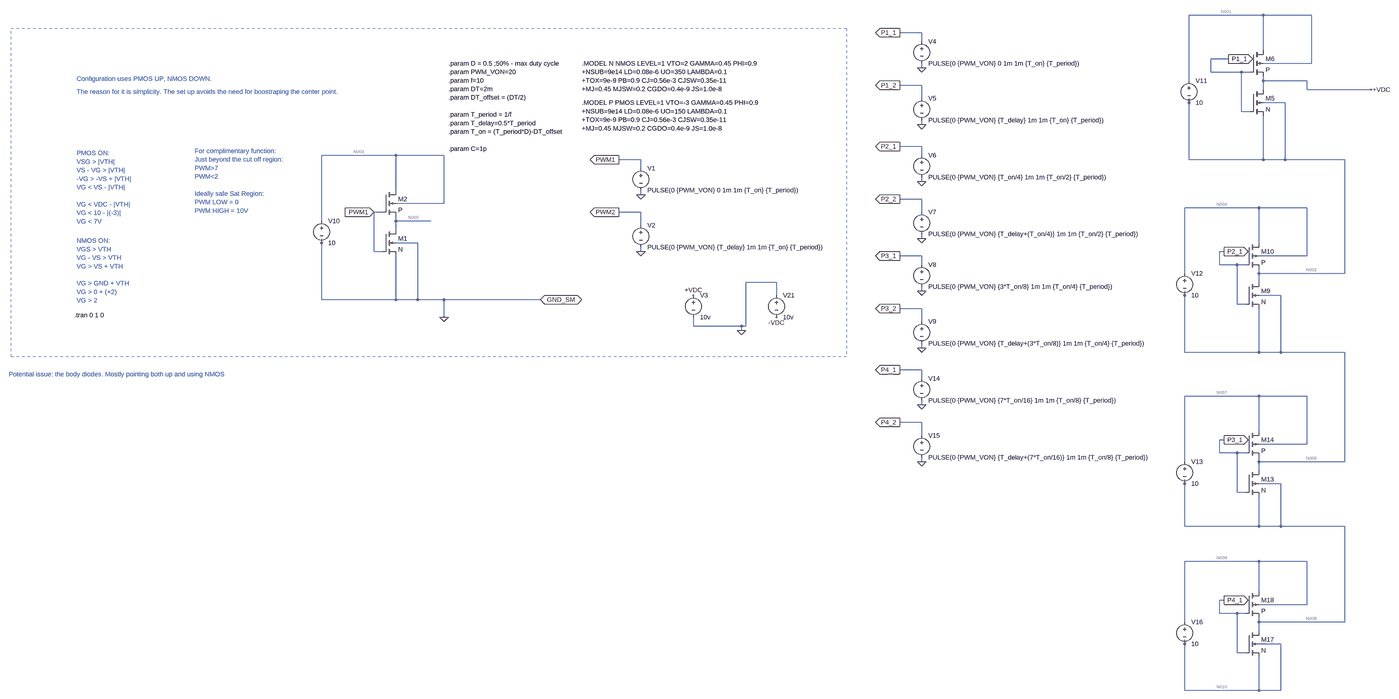
[diagram p0: schematic Half-Bridge.asc, whole sheet]
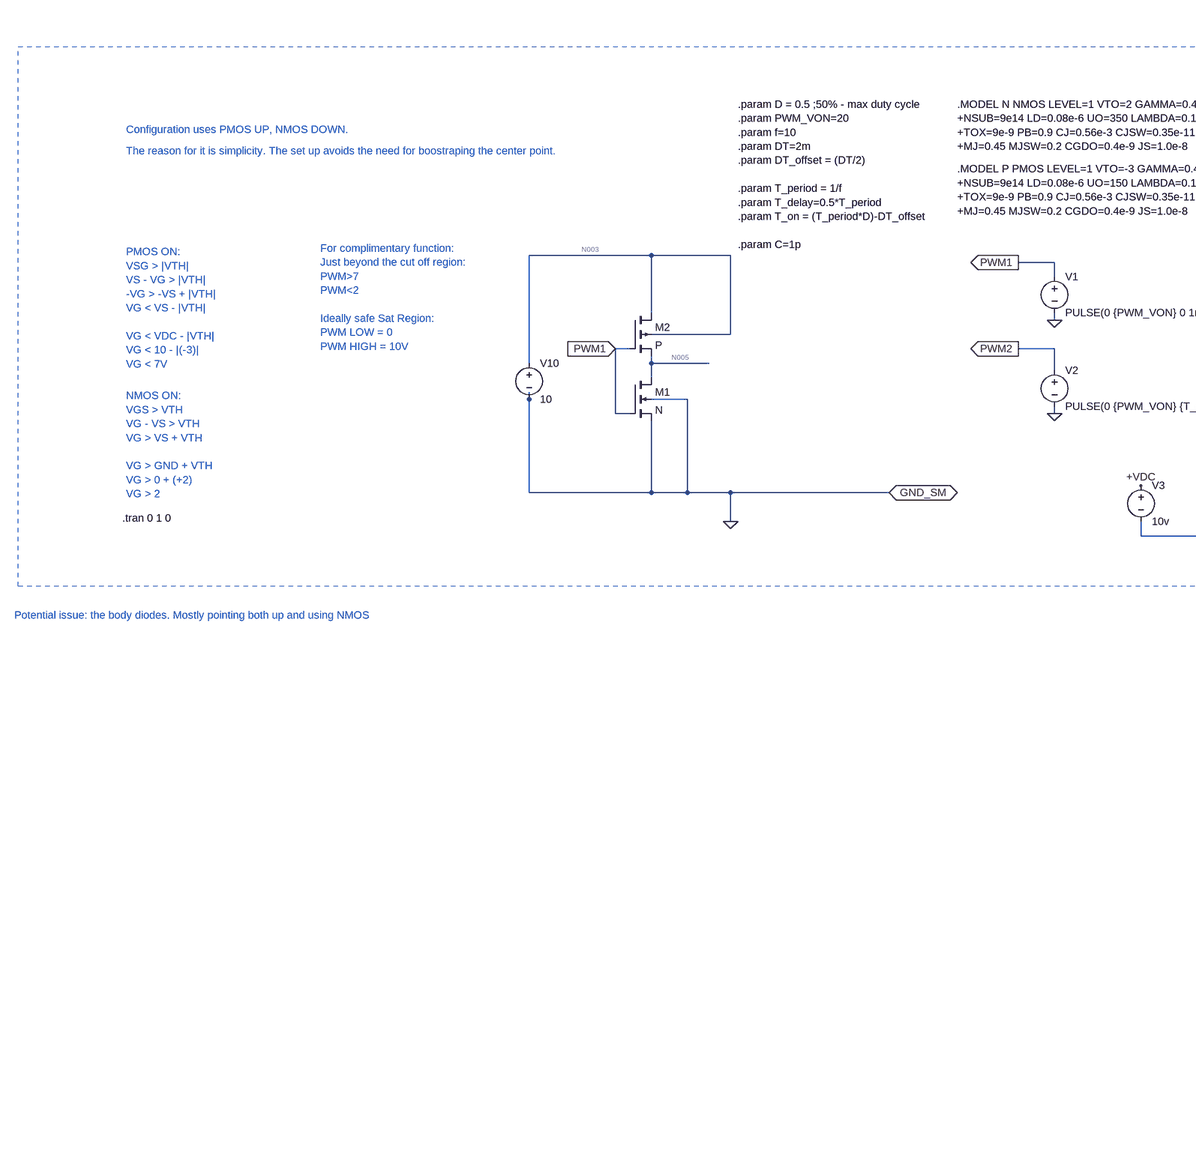
[diagram p1: schematic Half-Bridge.asc, part, row 1 of 1, column 1 of 2]
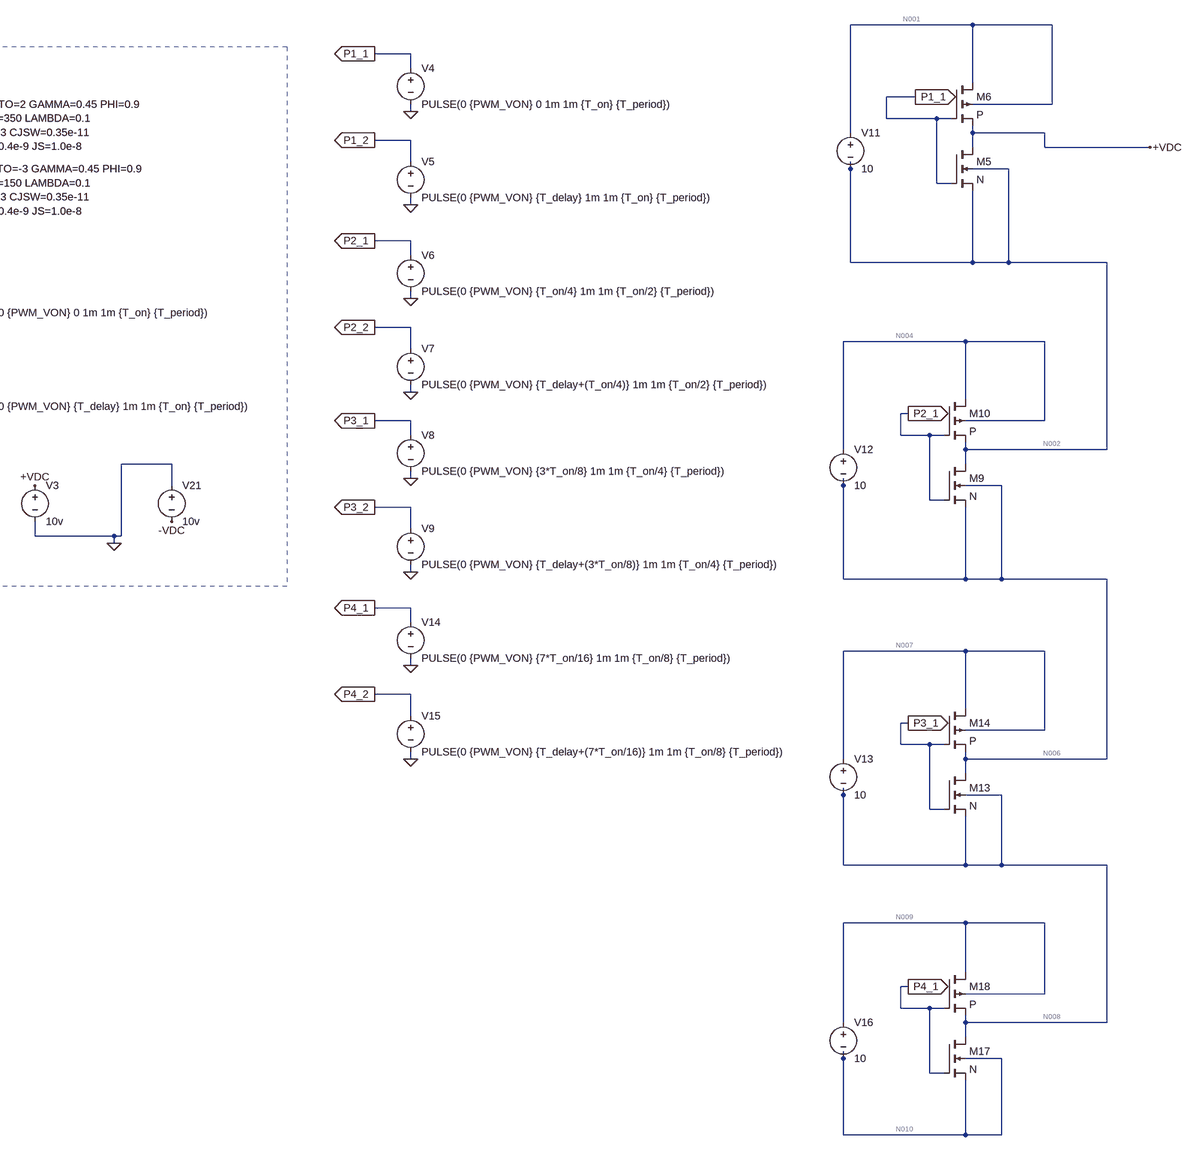
[diagram p2: schematic Half-Bridge.asc, part, row 1 of 1, column 2 of 2]
Half-Bridge.asc, the LTspice schematic file:
Version 4.1
SHEET 1 6916 5556
WIRE 5264 -480 4992 -480
WIRE 5440 -480 5264 -480
WIRE 3856 -416 3776 -416
WIRE 3856 -384 3856 -416
WIRE 5264 -352 5264 -480
WIRE 5136 -320 5072 -320
WIRE 5440 -304 5440 -480
WIRE 5440 -304 5264 -304
WIRE 3856 -288 3856 -304
WIRE 5072 -272 5072 -320
WIRE 5184 -272 5072 -272
WIRE 5216 -272 5184 -272
WIRE 4992 -240 4992 -480
WIRE 5264 -240 5264 -256
WIRE 5424 -240 5264 -240
WIRE 3856 -224 3776 -224
WIRE 5264 -208 5264 -240
WIRE 5424 -208 5424 -240
WIRE 5728 -208 5424 -208
WIRE 3856 -176 3856 -224
WIRE 4992 -160 4992 -176
WIRE 5344 -160 5264 -160
WIRE 5184 -128 5184 -272
WIRE 5216 -128 5184 -128
WIRE 3856 -80 3856 -96
WIRE 3856 0 3776 0
WIRE 1728 32 1456 32
WIRE 1904 32 1728 32
WIRE 3856 32 3856 0
WIRE 2624 48 2544 48
WIRE 4992 48 4992 -160
WIRE 5264 48 5264 -112
WIRE 5264 48 4992 48
WIRE 5344 48 5344 -160
WIRE 5344 48 5264 48
WIRE 5632 48 5344 48
WIRE 2624 80 2624 48
WIRE 3856 128 3856 112
WIRE 1728 160 1728 32
WIRE 2624 176 2624 160
WIRE 3856 192 3776 192
WIRE 1904 208 1904 32
WIRE 1904 208 1728 208
WIRE 5248 224 4976 224
WIRE 5424 224 5248 224
WIRE 1680 240 1648 240
WIRE 2624 240 2544 240
WIRE 3856 240 3856 192
WIRE 1456 272 1456 32
WIRE 1728 272 1728 256
WIRE 1856 272 1728 272
WIRE 2624 288 2624 240
WIRE 1728 304 1728 272
WIRE 3856 336 3856 320
WIRE 1456 352 1456 336
WIRE 1808 352 1728 352
WIRE 5248 352 5248 224
WIRE 1648 384 1648 240
WIRE 1680 384 1648 384
WIRE 2624 384 2624 368
WIRE 5120 384 5104 384
WIRE 3856 400 3776 400
WIRE 5424 400 5424 224
WIRE 5424 400 5248 400
WIRE 3856 432 3856 400
WIRE 5104 432 5104 384
WIRE 5168 432 5104 432
WIRE 5200 432 5168 432
WIRE 4976 464 4976 224
WIRE 5248 464 5248 448
WIRE 5632 464 5632 48
WIRE 5632 464 5248 464
WIRE 3120 496 3008 496
WIRE 5248 496 5248 464
WIRE 3856 528 3856 512
WIRE 3120 544 3120 496
WIRE 4976 544 4976 528
WIRE 5328 544 5248 544
WIRE 1456 560 1456 352
WIRE 1728 560 1728 400
WIRE 1728 560 1456 560
WIRE 1808 560 1808 352
WIRE 1808 560 1728 560
WIRE 1904 560 1808 560
WIRE 2256 560 1904 560
WIRE 5168 576 5168 432
WIRE 5200 576 5168 576
WIRE 3856 592 3776 592
WIRE 1904 624 1904 560
WIRE 3856 640 3856 592
WIRE 2816 656 2816 624
WIRE 2992 656 2816 656
WIRE 3008 656 3008 496
WIRE 3008 656 2992 656
WIRE 2992 672 2992 656
WIRE 3856 736 3856 720
WIRE 4976 752 4976 544
WIRE 5248 752 5248 592
WIRE 5248 752 4976 752
WIRE 5328 752 5328 544
WIRE 5328 752 5248 752
WIRE 5632 752 5328 752
WIRE 3856 816 3776 816
WIRE 3856 848 3856 816
WIRE 5248 912 4976 912
WIRE 5424 912 5248 912
WIRE 3856 944 3856 928
WIRE 3856 1008 3776 1008
WIRE 5248 1040 5248 912
WIRE 3856 1056 3856 1008
WIRE 5120 1072 5104 1072
WIRE 5424 1088 5424 912
WIRE 5424 1088 5248 1088
WIRE 5104 1120 5104 1072
WIRE 5168 1120 5104 1120
WIRE 5200 1120 5168 1120
WIRE 3856 1152 3856 1136
WIRE 4976 1152 4976 912
WIRE 5248 1152 5248 1136
WIRE 5632 1152 5632 752
WIRE 5632 1152 5248 1152
WIRE 5248 1184 5248 1152
WIRE 4976 1232 4976 1216
WIRE 5328 1232 5248 1232
WIRE 5168 1264 5168 1120
WIRE 5200 1264 5168 1264
WIRE 4976 1440 4976 1232
WIRE 5248 1440 5248 1280
WIRE 5248 1440 4976 1440
WIRE 5328 1440 5328 1232
WIRE 5328 1440 5248 1440
WIRE 5632 1440 5328 1440
WIRE 5248 1600 4976 1600
WIRE 5424 1600 5248 1600
WIRE 5248 1728 5248 1600
WIRE 5120 1760 5104 1760
WIRE 5424 1776 5424 1600
WIRE 5424 1776 5248 1776
WIRE 5104 1808 5104 1760
WIRE 5168 1808 5104 1808
WIRE 5200 1808 5168 1808
WIRE 4976 1840 4976 1600
WIRE 5248 1840 5248 1824
WIRE 5632 1840 5632 1440
WIRE 5632 1840 5248 1840
WIRE 5248 1872 5248 1840
WIRE 4976 1920 4976 1904
WIRE 5328 1920 5248 1920
WIRE 5168 1952 5168 1808
WIRE 5200 1952 5168 1952
WIRE 4976 2128 4976 1920
WIRE 5248 2128 5248 1968
WIRE 5248 2128 4976 2128
WIRE 5328 2128 5328 1920
WIRE 5328 2128 5248 2128
FLAG 1648 240 PWM1
IOPIN 1648 240 In
FLAG 2624 176 0
FLAG 2624 384 0
FLAG 2544 48 PWM1
IOPIN 2544 48 Out
FLAG 2544 240 PWM2
IOPIN 2544 240 Out
FLAG 2256 560 GND_SM
IOPIN 2256 560 BiDir
FLAG 1904 624 0
FLAG 3856 -288 0
FLAG 3856 -80 0
FLAG 3776 -416 P1_1
IOPIN 3776 -416 Out
FLAG 3776 -224 P1_2
IOPIN 3776 -224 Out
FLAG 3856 128 0
FLAG 3856 336 0
FLAG 3776 0 P2_1
IOPIN 3776 0 Out
FLAG 3776 192 P2_2
IOPIN 3776 192 Out
FLAG 3856 528 0
FLAG 3856 736 0
FLAG 3776 400 P3_1
IOPIN 3776 400 Out
FLAG 3776 592 P3_2
IOPIN 3776 592 Out
FLAG 5136 -320 P1_1
IOPIN 5136 -320 Out
FLAG 5120 384 P2_1
IOPIN 5120 384 Out
FLAG 5120 1072 P3_1
IOPIN 5120 1072 Out
FLAG 3856 944 0
FLAG 3856 1152 0
FLAG 3776 816 P4_1
IOPIN 3776 816 Out
FLAG 3776 1008 P4_2
IOPIN 3776 1008 Out
FLAG 5120 1760 P4_1
IOPIN 5120 1760 Out
FLAG 2992 672 0
FLAG 2816 544 +VDC
FLAG 3120 624 -VDC
FLAG 5728 -208 +VDC
SYMBOL nmos4 1680 304 R0
SYMATTR InstName M1
SYMATTR Value N
SYMBOL pmos4 1680 160 R0
SYMATTR InstName M2
SYMATTR Value P
SYMBOL voltage 2624 64 R0
WINDOW 123 0 0 Left 0
WINDOW 39 0 0 Left 0
SYMATTR InstName V1
SYMATTR Value PULSE(0 {PWM_VON} 0 1m 1m {T_on} {T_period})
SYMBOL voltage 2624 272 R0
WINDOW 123 0 0 Left 0
WINDOW 39 0 0 Left 0
SYMATTR InstName V2
SYMATTR Value PULSE(0 {PWM_VON} {T_delay} 1m 1m {T_on} {T_period})
SYMBOL voltage 2816 528 R0
WINDOW 123 0 0 Left 0
WINDOW 39 0 0 Left 0
SYMATTR InstName V3
SYMATTR Value 10v
SYMBOL voltage 3856 -400 R0
WINDOW 123 0 0 Left 0
WINDOW 39 0 0 Left 0
SYMATTR InstName V4
SYMATTR Value PULSE(0 {PWM_VON} 0 1m 1m {T_on} {T_period})
SYMBOL voltage 3856 -192 R0
WINDOW 123 0 0 Left 0
WINDOW 39 0 0 Left 0
SYMATTR InstName V5
SYMATTR Value PULSE(0 {PWM_VON} {T_delay} 1m 1m {T_on} {T_period})
SYMBOL voltage 3856 16 R0
WINDOW 123 0 0 Left 0
WINDOW 39 0 0 Left 0
SYMATTR InstName V6
SYMATTR Value PULSE(0 {PWM_VON} {T_on/4} 1m 1m {T_on/2} {T_period})
SYMBOL voltage 3856 224 R0
WINDOW 123 0 0 Left 0
WINDOW 39 0 0 Left 0
SYMATTR InstName V7
SYMATTR Value PULSE(0 {PWM_VON} {T_delay+(T_on/4)} 1m 1m {T_on/2} {T_period})
SYMBOL voltage 3856 416 R0
WINDOW 123 0 0 Left 0
WINDOW 39 0 0 Left 0
SYMATTR InstName V8
SYMATTR Value PULSE(0 {PWM_VON} {3*T_on/8} 1m 1m {T_on/4} {T_period})
SYMBOL voltage 3856 624 R0
WINDOW 123 0 0 Left 0
WINDOW 39 0 0 Left 0
SYMATTR InstName V9
SYMATTR Value PULSE(0 {PWM_VON} {T_delay+(3*T_on/8)} 1m 1m {T_on/4} {T_period})
SYMBOL voltage 1456 256 R0
WINDOW 123 0 0 Left 0
WINDOW 39 0 0 Left 0
SYMATTR InstName V10
SYMATTR Value 10
SYMBOL nmos4 5216 -208 R0
SYMATTR InstName M5
SYMATTR Value N
SYMBOL pmos4 5216 -352 R0
SYMATTR InstName M6
SYMATTR Value P
SYMBOL voltage 4992 -256 R0
WINDOW 123 0 0 Left 0
WINDOW 39 0 0 Left 0
SYMATTR InstName V11
SYMATTR Value 10
SYMBOL nmos4 5200 496 R0
SYMATTR InstName M9
SYMATTR Value N
SYMBOL pmos4 5200 352 R0
SYMATTR InstName M10
SYMATTR Value P
SYMBOL voltage 4976 448 R0
WINDOW 123 0 0 Left 0
WINDOW 39 0 0 Left 0
SYMATTR InstName V12
SYMATTR Value 10
SYMBOL nmos4 5200 1184 R0
SYMATTR InstName M13
SYMATTR Value N
SYMBOL pmos4 5200 1040 R0
SYMATTR InstName M14
SYMATTR Value P
SYMBOL voltage 4976 1136 R0
WINDOW 123 0 0 Left 0
WINDOW 39 0 0 Left 0
SYMATTR InstName V13
SYMATTR Value 10
SYMBOL voltage 3856 832 R0
WINDOW 123 0 0 Left 0
WINDOW 39 0 0 Left 0
SYMATTR InstName V14
SYMATTR Value PULSE(0 {PWM_VON} {7*T_on/16} 1m 1m {T_on/8} {T_period})
SYMBOL voltage 3856 1040 R0
WINDOW 123 0 0 Left 0
WINDOW 39 0 0 Left 0
SYMATTR InstName V15
SYMATTR Value PULSE(0 {PWM_VON} {T_delay+(7*T_on/16)} 1m 1m {T_on/8} {T_period})
SYMBOL nmos4 5200 1872 R0
SYMATTR InstName M17
SYMATTR Value N
SYMBOL pmos4 5200 1728 R0
SYMATTR InstName M18
SYMATTR Value P
SYMBOL voltage 4976 1824 R0
WINDOW 123 0 0 Left 0
WINDOW 39 0 0 Left 0
SYMATTR InstName V16
SYMATTR Value 10
SYMBOL voltage 3120 528 R0
WINDOW 123 0 0 Left 0
WINDOW 39 0 0 Left 0
SYMATTR InstName V21
SYMATTR Value 10v
TEXT 2408 -304 Left 2 !.MODEL N NMOS LEVEL=1 VTO=2 GAMMA=0.45 PHI=0.9\n+NSUB=9e14 LD=0.08e-6 UO=350 LAMBDA=0.1\n+TOX=9e-9 PB=0.9 CJ=0.56e-3 CJSW=0.35e-11\n+MJ=0.45 MJSW=0.2 CGDO=0.4e-9 JS=1.0e-8
TEXT 2408 -160 Left 2 !.MODEL P PMOS LEVEL=1 VTO=-3 GAMMA=0.45 PHI=0.9\n+NSUB=9e14 LD=0.08e-6 UO=150 LAMBDA=0.1\n+TOX=9e-9 PB=0.9 CJ=0.56e-3 CJSW=0.35e-11\n+MJ=0.45 MJSW=0.2 CGDO=0.4e-9 JS=1.0e-8
TEXT 560 -248 Left 2 ;Configuration uses PMOS UP, NMOS DOWN.
TEXT 560 -200 Left 2 ;The reason for it is simplicity. The set up avoids the need for boostraping the center point.
TEXT 560 24 Left 2 ;PMOS ON: \nVSG > |VTH| \nVS - VG > |VTH| \n-VG > -VS + |VTH| \nVG < VS - |VTH| \n \nVG < VDC - |VTH| \nVG < 10 - |(-3)|\nVG < 7V
TEXT 560 344 Left 2 ;NMOS ON:\nVGS > VTH\nVG - VS > VTH \nVG > VS + VTH\n \nVG > GND + VTH \nVG > 0 + (+2) \nVG > 2
TEXT 992 16 Left 2 ;For complimentary function: \nJust beyond the cut off region: \nPWM>7 \nPWM<2\n \nIdeally safe Sat Region: \nPWM LOW = 0\nPWM HIGH = 10V
TEXT 552 616 Left 2 !.tran 0 1 0
TEXT 1920 -304 Left 2 !.param D = 0.5 ;50% - max duty cycle\n.param PWM_VON=20\n.param f=10\n.param DT=2m\n.param DT_offset = (DT/2)\n \n.param T_period = 1/f\n.param T_delay=0.5*T_period\n.param T_on = (T_period*D)-DT_offset\n \n.param C=1p
TEXT 312 832 Left 2 ;Potential issue: the body diodes. Mostly pointing both up and using NMOS
RECTANGLE Normal 3376 768 320 -432 2

The netlist it stands for:
* Half-Bridge.asc
M1 N005 PWM1 0 0 N
M2 N003 PWM1 N005 N003 P
V1 PWM1 0 PULSE(0 {PWM_VON} 0 1m 1m {T_on} {T_period})
V2 PWM2 0 PULSE(0 {PWM_VON} {T_delay} 1m 1m {T_on} {T_period})
V3 +VDC 0 10v
V4 P1_1 0 PULSE(0 {PWM_VON} 0 1m 1m {T_on} {T_period})
V5 P1_2 0 PULSE(0 {PWM_VON} {T_delay} 1m 1m {T_on} {T_period})
V6 P2_1 0 PULSE(0 {PWM_VON} {T_on/4} 1m 1m {T_on/2} {T_period})
V7 P2_2 0 PULSE(0 {PWM_VON} {T_delay+(T_on/4)} 1m 1m {T_on/2} {T_period})
V8 P3_1 0 PULSE(0 {PWM_VON} {3*T_on/8} 1m 1m {T_on/4} {T_period})
V9 P3_2 0 PULSE(0 {PWM_VON} {T_delay+(3*T_on/8)} 1m 1m {T_on/4} {T_period})
V10 N003 0 10
M5 +VDC P1_1 N002 N002 N
M6 N001 P1_1 +VDC N001 P
V11 N001 N002 10
M9 N002 P2_1 N006 N006 N
M10 N004 P2_1 N002 N004 P
V12 N004 N006 10
M13 N006 P3_1 N008 N008 N
M14 N007 P3_1 N006 N007 P
V13 N007 N008 10
V14 P4_1 0 PULSE(0 {PWM_VON} {7*T_on/16} 1m 1m {T_on/8} {T_period})
V15 P4_2 0 PULSE(0 {PWM_VON} {T_delay+(7*T_on/16)} 1m 1m {T_on/8} {T_period})
M17 N008 P4_1 N010 N010 N
M18 N009 P4_1 N008 N009 P
V16 N009 N010 10
V21 0 -VDC 10v
.model NMOS NMOS
.model PMOS PMOS
.lib standard.mos
.MODEL N NMOS LEVEL=1 VTO=2 GAMMA=0.45 PHI=0.9
+NSUB=9e14 LD=0.08e-6 UO=350 LAMBDA=0.1
+TOX=9e-9 PB=0.9 CJ=0.56e-3 CJSW=0.35e-11
+MJ=0.45 MJSW=0.2 CGDO=0.4e-9 JS=1.0e-8
.MODEL P PMOS LEVEL=1 VTO=-3 GAMMA=0.45 PHI=0.9
+NSUB=9e14 LD=0.08e-6 UO=150 LAMBDA=0.1
+TOX=9e-9 PB=0.9 CJ=0.56e-3 CJSW=0.35e-11
+MJ=0.45 MJSW=0.2 CGDO=0.4e-9 JS=1.0e-8
* Configuration uses PMOS UP, NMOS DOWN.
* The reason for it is simplicity. The set up avoids the need for boostraping the center point.
* PMOS ON:
* VSG > |VTH|
* VS - VG > |VTH|
* -VG > -VS + |VTH|
* VG < VS - |VTH|
* VG < VDC - |VTH|
* VG < 10 - |(-3)|
* VG < 7V
* NMOS ON:
* VGS > VTH
* VG - VS > VTH
* VG > VS + VTH
* VG > GND + VTH
* VG > 0 + (+2)
* VG > 2
* For complimentary function:
* Just beyond the cut off region:
* PWM>7
* PWM<2
* Ideally safe Sat Region:
* PWM LOW = 0
* PWM HIGH = 10V
.tran 0 1 0
.param D = 0.5 ;50% - max duty cycle
.param PWM_VON=20
.param f=10
.param DT=2m
.param DT_offset = (DT/2)
.param T_period = 1/f
.param T_delay=0.5*T_period
.param T_on = (T_period*D)-DT_offset
.param C=1p
* Potential issue: the body diodes. Mostly pointing both up and using NMOS
.backanno
.end

* Results of the author's LTspice run, read from the files saved beside the schematic
* Operating Point, zero values left out:
*   V(+vdc) = 10 V
*   V(n002) = 49.59 nV
*   V(n001) = 10 V
*   V(n004) = 5.946 V
*   V(n010) = -5.229 V
*   V(n005) = 10 V
*   V(n003) = 10 V
*   V(n006) = -4.054 V
*   V(n008) = -4.81 V
*   V(n007) = 5.19 V
*   V(n009) = 4.771 V
*   V(-vdc) = -10 V
*   Id(M1) = 20.01 pA
*   Is(M1) = -10 pA
*   Ib(M1) = -10.01 pA
*   Id(M5) = 20.01 pA
*   Is(M5) = -10 pA
*   Ib(M5) = -10.01 pA
*   Id(M6) = 20.01 pA
*   Is(M6) = -20.01 pA
*   Id(M13) = 266 µA
*   Is(M13) = -266 µA
*   Id(M17) = 177.1 µA
*   Is(M17) = -177.1 µA
*   I(V16) = -177.1 µA
*   Id(M9) = 398.8 µA
*   Is(M9) = -398.8 µA
*   Ib(M9) = -4.064 pA
*   I(V13) = -266 µA
*   I(V10) = -20.01 pA
*   I(V11) = -20.01 pA
*   Id(M10) = 398.8 µA
*   Is(M10) = -398.8 µA
*   Ib(M10) = 5.956 pA
*   Id(M18) = 177.1 µA
*   Is(M18) = -177.1 µA
*   Ib(M18) = 9.591 pA
*   Id(M2) = 20.01 pA
*   Is(M2) = -20.01 pA
*   I(V12) = -398.8 µA
*   Id(M14) = 266 µA
*   Is(M14) = -266 µA
*   Ib(M14) = 9.254 pA
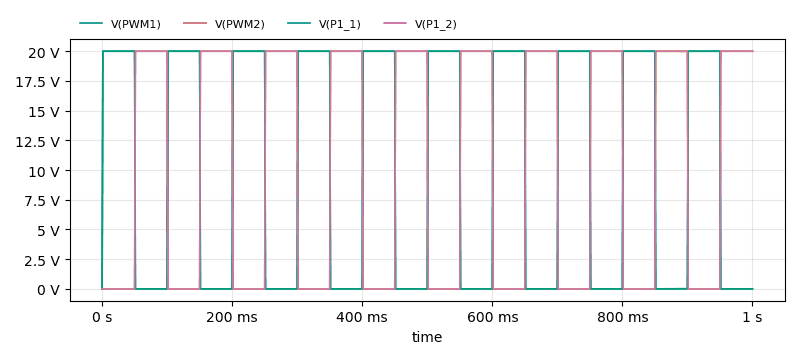
[diagram p3: Transient Analysis of Half-Bridge.asc, plotted from the saved traces]
* Transient Analysis, 1 run:
*   V(PWM1): min 0 V, max 20 V, average 10 V, rms 14.1 V, last 0 V
*   V(PWM2): min 0 V, max 20 V, average 9.99 V, rms 14.09 V, last 20 V
*   V(P1_1): min 0 V, max 20 V, average 10 V, rms 14.1 V, last 0 V
*   V(P1_2): min 0 V, max 20 V, average 9.99 V, rms 14.09 V, last 20 V